# EAGLE schematic ww-impedance-matching-circuit (EAGLE 9.5.2)
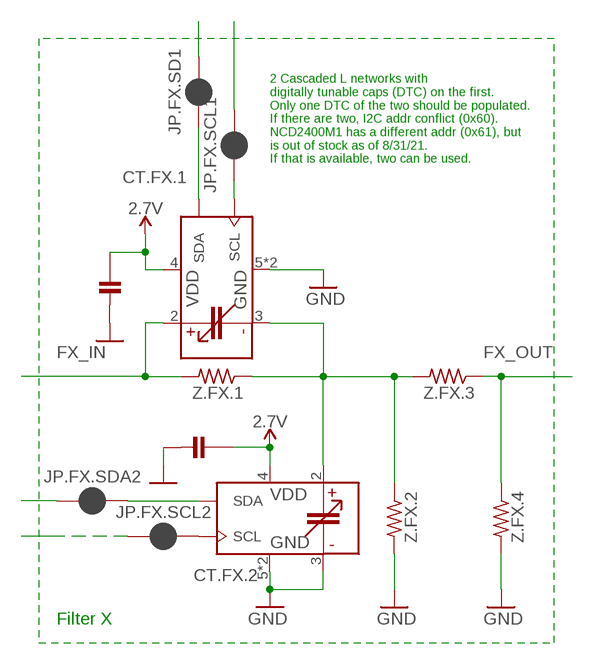
[diagram p0: schematic, sheet 1]

## Parts
C1  C-0603  [C0603]
C2  C-0603  [C0603]
CT.FX.1  TUNABLE_CAP_NCD2400MTR  [DFN-6_NCD2400M]
CT.FX.2  TUNABLE_CAP_NCD2400MTR  [DFN-6_NCD2400M]
JP.FX.SCL1  JUMPER-SMT_2_NC_PASTE_NO-SILK  [SMT-JUMPER_2_NC_PASTE_NO-SILK]
JP.FX.SCL2  JUMPER-SMT_2_NC_PASTE_NO-SILK  [SMT-JUMPER_2_NC_PASTE_NO-SILK]
JP.FX.SD1  JUMPER-SMT_2_NC_PASTE_NO-SILK  [SMT-JUMPER_2_NC_PASTE_NO-SILK]
JP.FX.SDA2  JUMPER-SMT_2_NC_PASTE_NO-SILK  [SMT-JUMPER_2_NC_PASTE_NO-SILK]
Z.FX.1  R-0603  [R0603]
Z.FX.2  R-0603  [R0603]
Z.FX.3  R-0603  [R0603]
Z.FX.4  R-0603  [R0603]

## Nets
2.7V: C1.1 C2.1 CT.FX.1.4(VDD) CT.FX.2.4(VDD)
FX_IN: CT.FX.1.2(C+) Z.FX.1.2
FX_OUT: Z.FX.3.1 Z.FX.4.1
GND: C1.2 C2.2 CT.FX.1.5(GND) CT.FX.1.7(GND) CT.FX.2.3(C-) CT.FX.2.5(GND) CT.FX.2.7(GND) Z.FX.2.2 Z.FX.4.2
N$4: CT.FX.1.3(C-) CT.FX.2.2(C+) Z.FX.1.1 Z.FX.2.1 Z.FX.3.2
N$10: CT.FX.1.1(SDA) JP.FX.SD1.2
N$12: CT.FX.2.1(SDA) JP.FX.SDA2.1
N$13: CT.FX.2.6(SCL) JP.FX.SCL2.1
N$14: CT.FX.1.6(SCL) JP.FX.SCL1.2
N$16: JP.FX.SCL2.2
N$17: JP.FX.SD1.1
N$18: JP.FX.SCL1.1
N$19: JP.FX.SDA2.2

## Notes on the sheet
- 2 Cascaded L networks with 
  digitally tunable caps (DTC) on the first. 
  Only one DTC of the two should be populated. 
  If there are two, I2C addr conflict (0x60).
  NCD2400M1 has a different addr (0x61), but
  is out of stock as of 8/31/21. 
  If that is available, two can be used.
- Filter X

## Library data of the parts
C1 C2 = Capacitors:C-: Capacitor, Surface Mount; MANUFACTURER: Kemet; TC: X7R; TOL: 10%; VOLTAGE: 6.3V
CT.FX.1 CT.FX.2 = Capacitors:TUNABLE_CAP_NCD2400MTR: Digitally Tunable Capacitor NCD2400M from IXYS; MP: NCD2400M; MPN: NCD2400M; PART_NO: NCD2400M
JP.FX.SCL1 JP.FX.SCL2 JP.FX.SD1 JP.FX.SDA2 = Connectors:JUMPER-SMT_2_NC_PASTE: Normally closed solder jumper This jumper has an aperture in the stencil to allow solder paste to bridge the split in the wire so it's normally closed (NC). Wick off the solder to open the connection. Reapply solder to reclose the connection.; BOM: EXCLUDE
Z.FX.1-Z.FX.4 = Resistors:R-: Resistor, Surface Mount; MANUFACTURER: Panasonic; TOL: 5%